# EAGLE design multivibrator (EAGLE 5.07)
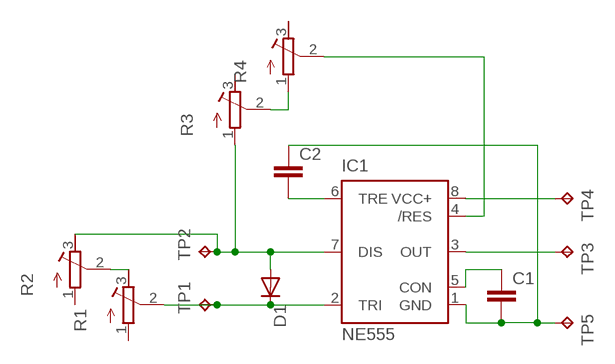
[diagram p0: schematic, sheet 1]

## Parts
C1  C7.5/3  [C7.5B3]
C2  C7.5/3  [C7.5B3]
D1  DIODEPTH  [DIODE-1N4001]
IC1  NE555  [DIL-08]
R1  R-TRIMM64W  [RTRIM64W]
R2  R-TRIMM64W  [RTRIM64W]
R3  R-TRIMM64W  [RTRIM64W]
R4  R-TRIMM64W  [RTRIM64W]
TP1  TPPAD1-13  [P1-13]
TP2  TPPAD1-13  [P1-13]
TP3  TPPAD1-13  [P1-13]
TP4  TPPAD1-13  [P1-13]
TP5  TPPAD1-13  [P1-13]

## Nets
GND: C1.2 C2.1 IC1.1(GND) TP5.TP
N$1: D1.A IC1.7(DIS) R2.3(A) R3.1(E) TP2.TP
N$2: D1.C IC1.2(TRI) R1.2(S) TP1.TP
N$3: C2.2 IC1.6(TRE)
N$4: C1.1 IC1.5(CON)
N$6: R1.3(A) R2.2(S)
N$7: R3.2(S) R4.1(E)
N$8: IC1.4(/RES) R4.2(S)
N$9: IC1.3(OUT) TP3.TP
VCC: IC1.8(VCC+) TP4.TP
Unconnected: R1.1(E) R2.1(E) R3.3(A) R4.3(A)

## Library data of the parts
C1 C2 = capacitor-wima:C: CAPACITOR naming: grid - package width
D1 = SparkFun:DIODE: Diode These are standard reverse protection diodes and small signal diodes. SMA package can handle up to about 1A. SOD-323 can handle about 200mA. What the SOD-323 package when ordering, there are some mfgs out there that are 5-pin packages.
IC1 = st-microelectronics:NE555: General purpose bipolar Timer
R1-R4 = resistor:R-TRIMM: Trimm resistor
TP1-TP5 = testpad:TP: Test pad

## Board
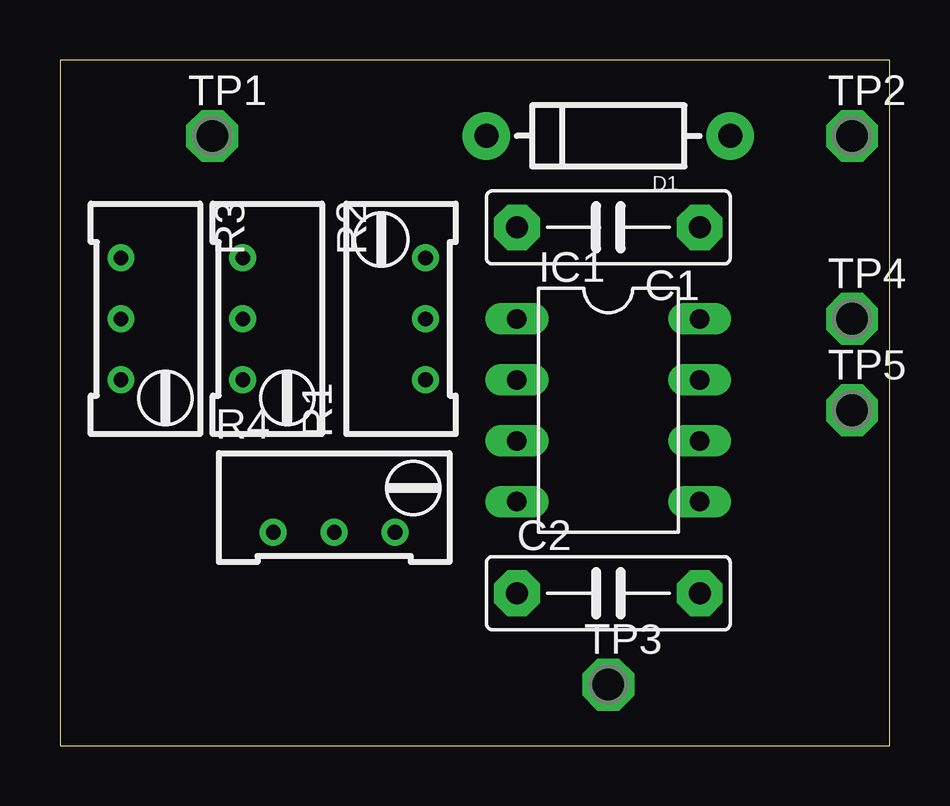
[diagram p1: board, top side]
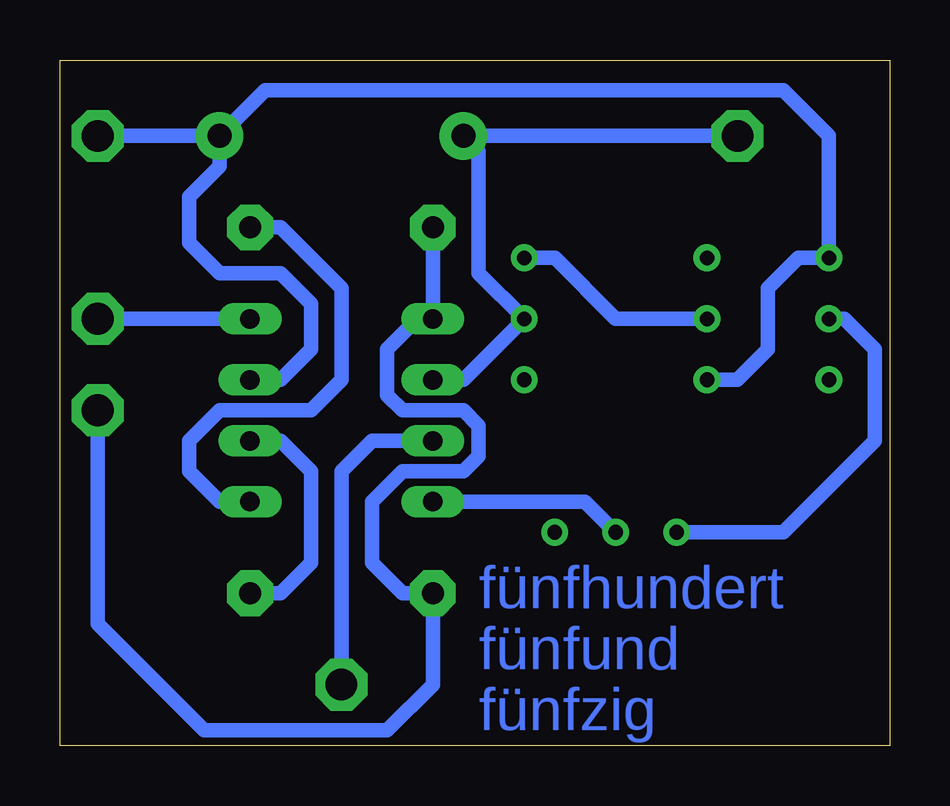
[diagram p2: board, bottom side, seen from below]

Size 34.59 x 28.57 mm. Coordinates in mm from the lower left corner, seen from the top.
Outline: 0,0 34.59,0 34.59,28.57 0,28.57 0,0
Copper layers (1*16): Top 0.035mm / dielectric 1.5mm / Bottom 0.035mm
Design rules "default": minimum track width 10mil, minimum drill 24mil, track to track 8mil, track to pad 8mil, pad to pad 8mil, via to via 8mil, smd to smd 8mil, copper to edge 40mil, drill to drill 8mil, minimum pad ring 10mil, minimum via ring 8mil, stop-mask expansion 4mil, vias tented up to drill 0mil, thermal gap 10mil

### Footprints (pad centres in the part's own frame; a part is rotated, then mirrored left to right if it is on the bottom)
C7.5B3 = drill 0.914 pad 1.905 octagon: 1 -3.81,0; 2 3.81,0
DIODE-1N4001 = drill 1 pad 1.981 round: A -5.08,0; C 5.08,0
DIL-08 = drill 0.813 long: 1 -3.81,-3.81; 2 -1.27,-3.81; 3 1.27,-3.81; 4 3.81,-3.81; 5 3.81,3.81; 6 1.27,3.81; 7 -1.27,3.81; 8 -3.81,3.81
RTRIM64W = drill 0.61 round: 1 1.27,-2.54; 2 1.27,0; 3 1.27,2.54
P1-13 = drill 1.321 pad 2.159 octagon: TP 0,0

### Placement (x,y rotation side)
C1  22.86,21.59 180 top
C2  22.86,6.35 0 top
D1  22.86,25.4 180 top
IC1  22.86,13.97 270 top
R1  13.97,17.78 0 top
R2  8.89,17.78 180 top
R3  3.81,17.78 180 top
R4  11.43,10.16 270 top
TP1  6.35,25.4 0 top
TP2  33.02,25.4 0 top
TP3  22.86,2.54 0 top
TP4  33.02,17.78 0 top
TP5  33.02,13.97 0 top

### Tracks (layer width: path | path; a pad name or v marks a point on that pad's centre or on a via)
GND
  Bottom 0.61: C1.2 IC1.1 19.68,17.78 20.95,16.51 20.95,14.61 20.32,13.97 17.78,13.97 17.14,13.34 17.14,12.06 17.78,11.43 20.32,11.43 21.59,10.16 21.59,7.62 20.32,6.35 C2.1 19.05,2.54 20.95,0.64 28.57,0.64 33.02,5.08 TP5.TP
N$1
  Bottom 0.61: D1.A TP2.TP | R2.3 6.35,15.24 5.08,16.51 5.08,19.05 3.81,20.32 R3.1 2.54,25.4 4.45,27.3 26.04,27.3 D1.A | IC1.7 25.4,15.24 24.13,16.51 24.13,18.41 25.4,19.68 27.94,19.68 29.21,20.95 29.21,22.86 27.94,24.13 D1.A
N$2
  Bottom 0.61: TP1.TP D1.C 17.14,24.77 17.14,19.68 R1.2 17.78,15.24 IC1.2
N$3
  Bottom 0.61: C2.2 25.4,6.35 24.13,7.62 24.13,11.43 25.4,12.7 IC1.6
N$4
  Bottom 0.61: C1.1 25.4,21.59 22.86,19.05 22.86,15.24 24.13,13.97 27.94,13.97 29.21,12.7 29.21,11.43 27.94,10.16 IC1.5
N$6
  Bottom 0.61: R2.2 11.43,17.78 13.97,20.32 R1.3
N$7
  Bottom 0.61: R4.1 4.45,8.89 0.64,12.7 0.64,16.51 1.91,17.78 R3.2
N$8
  Bottom 0.61: R4.2 12.7,10.16 IC1.4
N$9
  Bottom 0.61: TP3.TP 22.86,11.43 21.59,12.7 IC1.3
VCC
  Bottom 0.61: IC1.8 TP4.TP

### Text on the board
Bottom: fünfhundert | fünfund | fünfzig